# Altium project zulu_a7_hdi_optimized.PrjPcb (part 1 of 2)
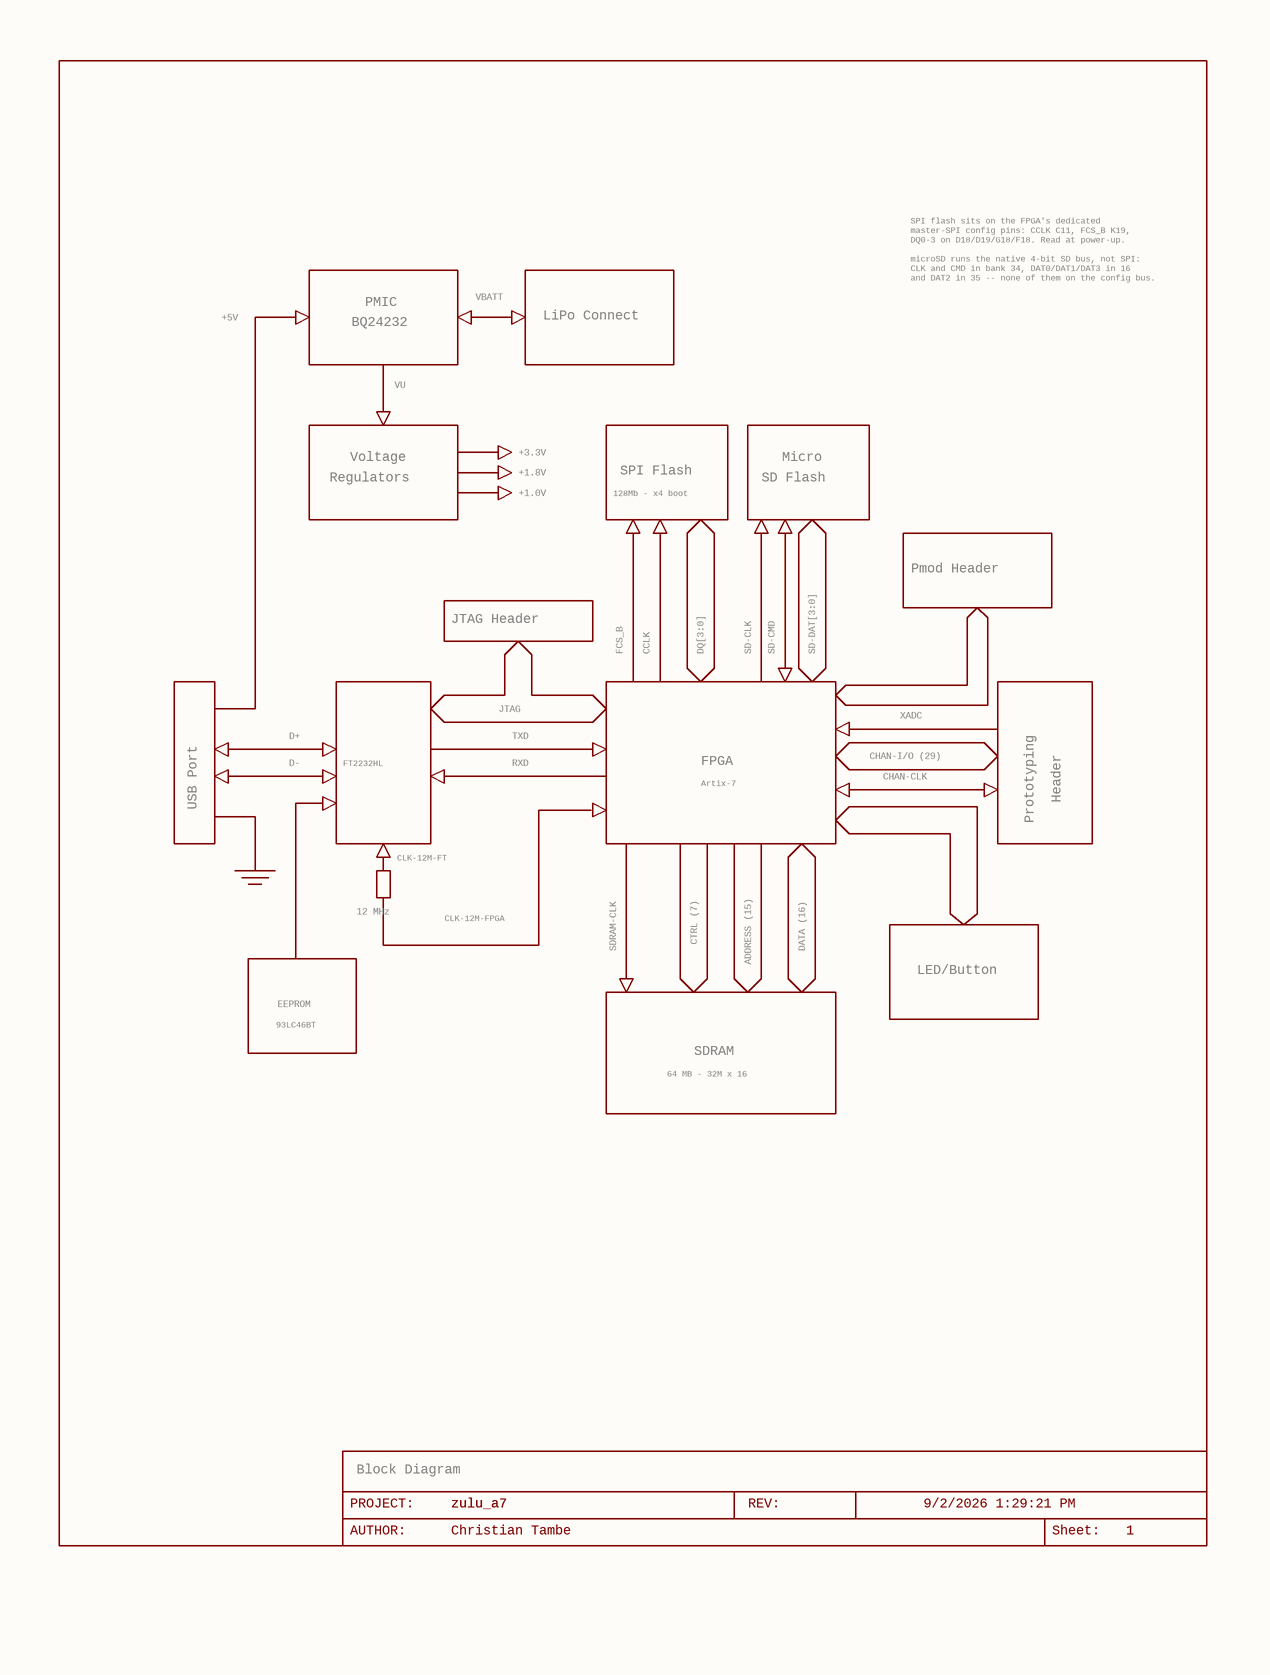
[diagram p0: zulu_a7_0.SchDoc]
6 sheets, 176 parts. Net scope: global (net labels, ports and power ports of the same name join across sheets).
Board file: zulu_a7_hdi_optimized.PcbDoc
Sheets:
  zulu_a7_0.SchDoc
  zulu_a7_1.SchDoc
  zulu_a7_2.SchDoc
  zulu_a7_3.SchDoc
  zulu_a7_4.SchDoc
  zulu_a7_6.SchDoc

## Sheet zulu_a7_0.SchDoc
size 236 x 313 mm; Author: Christian Tambe; VERSION#: 1.0; Origin: Eagle; OriginPath: C:\Users\tambe\Documents\Electronics\Zulu_A7\Zulu_Altrium\zulu_a7.sch; OriginSheet: 1; OriginDescription: Block Diagram

### Parts
FRAME1  LAST_DATE_TIME: 9/2/2026 1:29:21 PM  Sheet: Sheet:  SHEET: 1  REV: REV:  PROJECT: PROJECT:  DRAWING_NAME: zulu_a7  AUTHOR: Christian Tambe  (hidden comment: DOCFIELD)  (graphical)

### Notes on the sheet
- SPI flash sits on the FPGA's dedicated
  master-SPI config pins: CCLK C11, FCS_B K19,
  DQ0-3 on D18/D19/G18/F18. Read at power-up.
  microSD runs the native 4-bit SD bus, not SPI:
  CLK and CMD in bank 34, DAT0/DAT1/DAT3 in 16
  and DAT2 in 35 -- none of them on the config bus.
- +5V
- BQ24232
- PMIC
- VBATT
- LiPo Connect
- VU
- Regulators
- Voltage
- +3.3V
- +1.8V
- SPI Flash
- SD Flash
- Micro
- +1.0V
- 128Mb - x4 boot
- Pmod Header
- JTAG Header
- FCS_B
- CCLK
- DQ[3:0]
- SD-CLK
- SD-CMD
- SD-DAT[3:0]
- D+
- JTAG
- TXD
- XADC
- USB Port
- D-
- FT2232HL
- RXD
- FPGA
- Artix-7
- CHAN-I/O (29)
- CHAN-CLK
- Prototyping
- Header
- CLK-12M-FT
- 12 MHz
- CLK-12M-FPGA
- SDRAM-CLK
- CTRL (7)
- DATA (16)
- EEPROM
- ADDRESS (15)
- LED/Button
- 93LC46BT
- 64 MB - 32M x 16
- SDRAM
- (near FRAME1) Block Diagram
- (near FRAME1) AUTHOR:

### Library data of the parts
FRAME1 = DOCFIELD: DOCUMENT FIELD; GateName_1: G$1; SymbolName_1: DOCFIELD; LibraryName: ctambe; DeviceSetName: DOCFIELD

## Sheet zulu_a7_1.SchDoc
size 236 x 314 mm; Author: Christian Tambe; VERSION#: 1.0; Origin: Eagle; OriginPath: C:\Users\tambe\Documents\Electronics\Zulu_A7\Zulu_Altrium\zulu_a7.sch; OriginSheet: 2; OriginDescription: Power Supplies
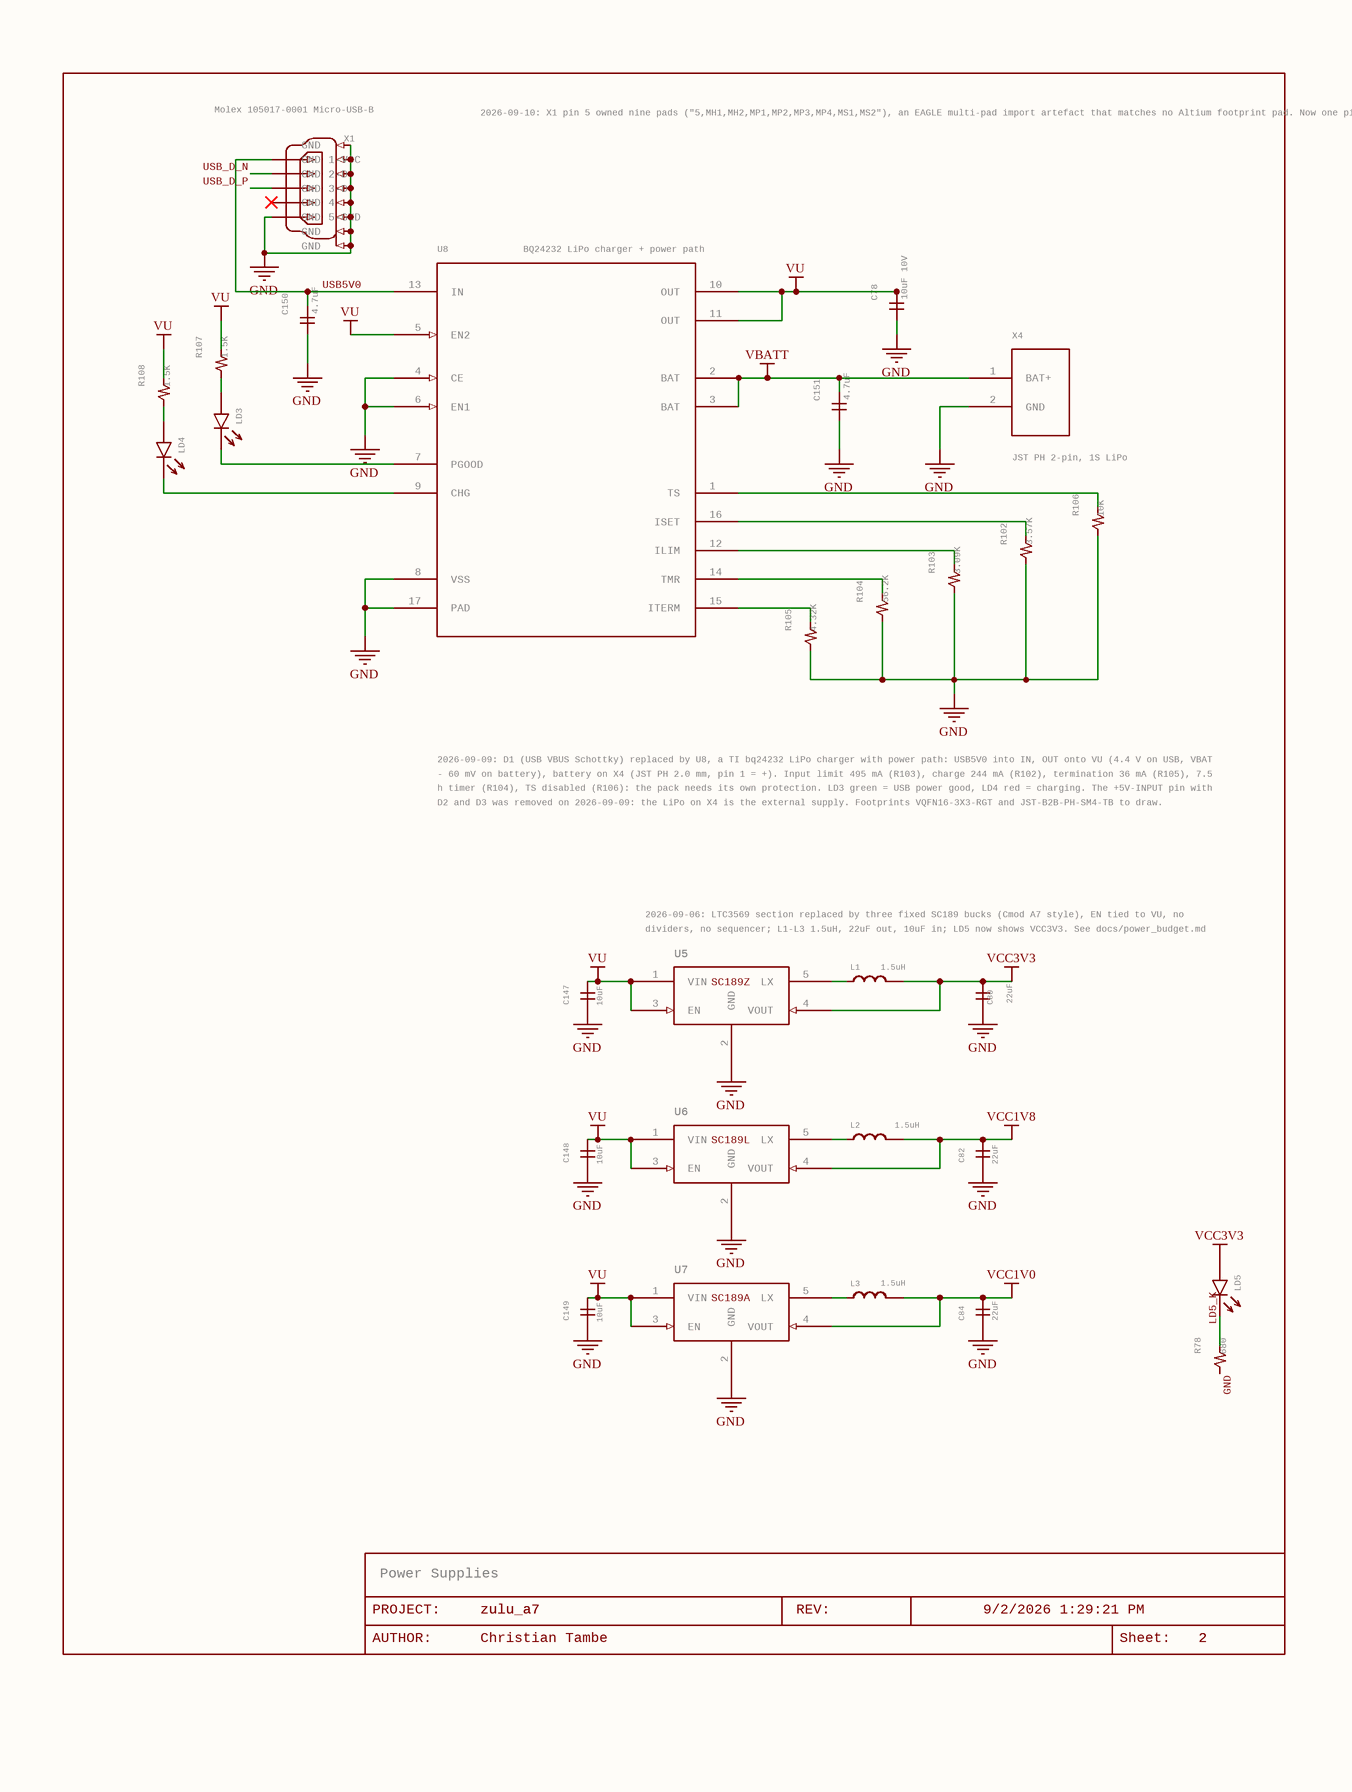
[diagram p1: zulu_a7_1.SchDoc]

### Parts
C78  10uF 10V  [C0805]
C80  22uF  [C0805]
C82  22uF  [C0603]
C84  22uF  [C0603]
C147  10uF  [C0805]
C148  10uF  [C0805]
C149  10uF  [C0805]
C150  4.7uF  [C0603]
C151  4.7uF  [C0603]
FRAME5  LAST_DATE_TIME: 9/2/2026 1:29:21 PM  Sheet: Sheet:  SHEET: 2  REV: REV:  PROJECT: PROJECT:  DRAWING_NAME: zulu_a7  AUTHOR: Christian Tambe  (hidden comment: DOCFIELD)  (graphical)
L1  1.5uH  [IND2520]
L2  1.5uH  [IND2520]
L3  1.5uH  [IND2520]
LD3  green  [LED0603]  (value not drawn)
LD4  red  [LED0603]  (value not drawn)
LD5  green  [LED0603]  (value not drawn)
R78  680  [R0402]
R102  3.57K  [R0402]
R103  3.09K  [R0402]
R104  56.2K  [R0402]
R105  4.32K  [R0402]
R106  10K  [R0402]
R107  1.5K  [R0402]
R108  1.5K  [R0402]
U5  PartName: SC189Z  [SOT23-5]  (hidden comment: SC189ZSKTRT)
U6  PartName: SC189L  [SOT23-5]  (hidden comment: SC189LSKTRT)
U7  PartName: SC189A  [SOT23-5]  (hidden comment: SC189ASKTRT)
U8  BQ24232 LiPo charger + power path  [VQFN16-3X3-RGT]
X1  Molex 105017-0001 Micro-USB-B  [MOLEX-105017-0001]
X4  JST PH 2-pin, 1S LiPo  [JST-B2B-PH-SM4-TB]

### Nets
GND: C78.1 C80.1 C82.1 C84.1 C147.1 C148.1 C149.1 C150.1 C151.1 R78.1 R102.1 R103.1 R104.1 R105.1 R106.1 U5.2(GND) U6.2(GND) U7.2(GND) U8.4(CE) U8.6(EN1) U8.8(VSS) U8.17(PAD) X1.5(5-GND) X1.MH1(GND) X1.MH2(GND) X1.MP1(GND) X1.MP2(GND) X1.MP3(GND) X1.MP4(GND) X1.MS1(GND) X1.MS2(GND) X4.2(GND)
VBATT: C151.2 U8.2(BAT) U8.3(BAT) X4.1(BAT+)
VCC1V0: C84.2 L3.2 U7.4(VOUT)
VCC1V8: C82.2 L2.2 U6.4(VOUT)
VCC3V3: C80.2 L1.2 LD5.A U5.4(VOUT)
VU: C78.2 C147.2 C148.2 C149.2 R107.2 R108.2 U5.1(VIN) U5.3(EN) U6.1(VIN) U6.3(EN) U7.1(VIN) U7.3(EN) U8.5(EN2) U8.10(OUT) U8.11(OUT)
LD5_K: LD5.K R78.2
USB5V0: C150.2 U8.13(IN) X1.1(1-VCC)
USB_D_N: X1.2(2-D-)
USB_D_P: X1.3(3-D+)
NetL1_1: L1.1 U5.5(LX)
NetL2_1: L2.1 U6.5(LX)
NetL3_1: L3.1 U7.5(LX)
NetLD3_A: LD3.A R107.1
NetLD3_K: LD3.K U8.7(PGOOD)
NetLD4_A: LD4.A R108.1
NetLD4_K: LD4.K U8.9(CHG)
NetR102_2: R102.2 U8.16(ISET)
NetR103_2: R103.2 U8.12(ILIM)
NetR104_2: R104.2 U8.14(TMR)
NetR105_2: R105.2 U8.15(ITERM)
NetR106_2: R106.2 U8.1(TS)

Not connected (* = marked no-connect by the designer): X1 4*

### Notes on the sheet
- 2026-09-10: X1 pin 5 owned nine pads ("5,MH1,MH2,MP1,MP2,MP3,MP4,MS1,MS2"), an EAGLE multi-pad import artefact that matches no Altium footprint pad. Now one pin per pad: 5 is USB GND, MH1/MH2 the mounting holes, MP1-MP4 the shell posts and MS1/MS2 the shield tabs, all on the same GND port.
- 2026-09-09: D1 (USB VBUS Schottky) replaced by U8, a TI bq24232 LiPo charger with power path: USB5V0 into IN, OUT onto VU (4.4 V on USB, VBAT
- - 60 mV on battery), battery on X4 (JST PH 2.0 mm, pin 1 = +). Input limit 495 mA (R103), charge 244 mA (R102), termination 36 mA (R105), 7.5
- h timer (R104), TS disabled (R106): the pack needs its own protection. LD3 green = USB power good, LD4 red = charging. The +5V-INPUT pin with
- D2 and D3 was removed on 2026-09-09: the LiPo on X4 is the external supply. Footprints VQFN16-3X3-RGT and JST-B2B-PH-SM4-TB to draw.
- 2026-09-06: LTC3569 section replaced by three fixed SC189 bucks (Cmod A7 style), EN tied to VU, no
- dividers, no sequencer; L1-L3 1.5uH, 22uF out, 10uF in; LD5 now shows VCC3V3. See docs/power_budget.md
- (near FRAME5) Power Supplies
- (near FRAME5) AUTHOR:

### Library data of the parts
C78 C147-C149 = C-GENERICC0805: CAPACITOR, generic non-polarized, horizontal pins; GateName_1: G$1; SymbolName_1: C-GENERIC-H; MANF: Samsung; MANF#: CL21A106KPFNNNG; SPEC: X5R 10V +-10% 0805 10uF; replaces the obsolete Murata GRM21BR61A106KE19L; DeviceName: C0805; LibraryName: rcl; DeviceSetName: C-GENERIC
C80 = C-GENERICC0805: CAPACITOR, generic non-polarized, horizontal pins; GateName_1: G$1; SymbolName_1: C-GENERIC-H; MANF: Murata; MANF#: GRM21BR61A226ME44L; SPEC: X5R 10V +-20%, 1.45 mm max -- SC189 COUT on VCC3V3, sense pin 4 lands here; DeviceName: C0805; LibraryName: rcl; DeviceSetName: C-GENERIC
C82 C84 = C-GENERICC0603: CAPACITOR, generic non-polarized, horizontal pins; GateName_1: G$1; SymbolName_1: C-GENERIC-H; MANF: Samsung; MANF#: CL10A226MP8NUNE; SPEC: X5R 10V +-20% 0603 22uF, 1.05 mm max (T 0.80 +-0.25); replaced the 6.3 V Murata GRM188R60J226MEA0D (1.00 mm max, dry until 2027) on 2026-09-07; DeviceName: C0603; LibraryName: rcl; DeviceSetName: C-GENERIC
C150 C151 = C-GENERICC0603: CAPACITOR, generic non-polarized, horizontal pins; GateName_1: G$1; SymbolName_1: C-GENERIC-H; MANF: Murata; MANF#: GRM188R61C475KE11D; SPEC: X5R 16V +-10% 0603 4.7uF, 0.95 mm max (bq24232 IN/BAT bypass, datasheet 1-10 uF on IN and 4.7-47 uF on BAT); DeviceName: C0603; LibraryName: rcl; DeviceSetName: C-GENERIC
FRAME5 = DOCFIELD: DOCUMENT FIELD; GateName_1: G$1; SymbolName_1: DOCFIELD; LibraryName: ctambe; DeviceSetName: DOCFIELD
L1-L3 = INDUCTOR-2520: INDUCTOR, generic power inductor; GateName_1: G$1; DeviceName: -2520; MANF: Murata; MANF#: DFE252010P-1R5M=P2; SPEC: 1.5uH +-20%, Isat >=1.8A, 1.00 mm max -- SC189 LX inductor, 2.5 MHz, <=0.31 A p-p ripple; SymbolName_1: INDUCTOR; LibraryName: ctambe; DeviceSetName: INDUCTOR
LD3 = LED: GateName_1: G$1; MANF: Lite-On; MANF#: LTST-C191KGKT; NOTE: Charger power-good: bq24232 PGOOD sinks LD3 through R107 1.5k from VU when a valid USB input is present; SPEC: green indicator, 0603, Vf 2.1V max at 2mA; SymbolName_1: LED; LibraryName: ctambe; DeviceSetName: LED
LD4 = LED: GateName_1: G$1; MANF: Lite-On; MANF#: LTST-C191KRKT; NOTE: Charging: bq24232 CHG sinks LD4 through R108 1.5k from VU while the battery charges, off when done or disabled; SPEC: red indicator, 0603, Vf 2.0V typ at 2mA; SymbolName_1: LED; LibraryName: ctambe; DeviceSetName: LED
LD5 = LED: GateName_1: G$1; MANF: Lite-On; MANF#: LTST-C191KGKT; NOTE: Power-good indicator: VCC3V3 to LD5 to R78 680R to Q2 drain to GND. SELECTED FROM THE CIRCUIT, not recovered -- the part carried no value and no number. THE RESISTOR ALREADY CHOSE THE COLOUR: 680R off 3.3 V passes (3.3 - Vf)/680, which is 1.9 mA for a green LED or 2.1 for a red, but only 0.6 mA for a blue or white one, too dim to read. So it is a green or red part, and green is the convention for power good. 1.9 mA is low but plain on a modern high-efficiency 0603; take R78 to 330R if you want it brighter.; SPEC: green indicator, 0603, Vf 2.1V max at 2mA; SymbolName_1: LED; LibraryName: ctambe; DeviceSetName: LED
R78 = R-US_SMALLR0402: RESISTOR, American symbol, small 2-zigzag variant (sheet 2 only); GateName_1: G$1; MANF: Yageo; MANF#: RC0402FR-07680RL; SPEC: thick film +-1%, 1/16W, 0402; SymbolName_1: R-US_SMALL; DeviceName: R0402; LibraryName: rcl; DeviceSetName: R-US_SMALL
R102 = R-US_SMALLR0402: RESISTOR, American symbol, small 2-zigzag variant (sheet 2 only); GateName_1: G$1; MANF: Yageo; MANF#: RC0402FR-073K57L; SPEC: thick film +-1%, 1/16W, 0402 -- ISET: 870 / 3.57k = 244 mA fast-charge current; SymbolName_1: R-US_SMALL; DeviceName: R0402; LibraryName: rcl; DeviceSetName: R-US_SMALL
R103 = R-US_SMALLR0402: RESISTOR, American symbol, small 2-zigzag variant (sheet 2 only); GateName_1: G$1; MANF: Yageo; MANF#: RC0402FR-073K09L; SPEC: thick film +-1%, 1/16W, 0402 -- ILIM: 1530 / 3.09k = 495 mA input current limit (EN2 = VU, EN1 = GND select the resistor); SymbolName_1: R-US_SMALL; DeviceName: R0402; LibraryName: rcl; DeviceSetName: R-US_SMALL
R104 = R-US_SMALLR0402: RESISTOR, American symbol, small 2-zigzag variant (sheet 2 only); GateName_1: G$1; MANF: Yageo; MANF#: RC0402FR-0756K2L; SPEC: thick film +-1%, 1/16W, 0402 -- TMR: 10 x 56.2k x 48 s/k = 7.5 h fast-charge and 45 min precharge safety timers; SymbolName_1: R-US_SMALL; DeviceName: R0402; LibraryName: rcl; DeviceSetName: R-US_SMALL
R105 = R-US_SMALLR0402: RESISTOR, American symbol, small 2-zigzag variant (sheet 2 only); GateName_1: G$1; MANF: Yageo; MANF#: RC0402FR-074K32L; SPEC: thick film +-1%, 1/16W, 0402 -- ITERM: 0.03 A x 4.32k / 3.57k = 36 mA termination (15 % of the charge current); SymbolName_1: R-US_SMALL; DeviceName: R0402; LibraryName: rcl; DeviceSetName: R-US_SMALL
R106 = R-US_SMALLR0402: RESISTOR, American symbol, small 2-zigzag variant (sheet 2 only); GateName_1: G$1; MANF: Yageo; MANF#: RC0402FR-0710KL; SPEC: thick film +-1%, 1/16W, 0402 -- TS: fixed 10k disables the pack-temperature check (2-pin pack, no NTC); the pack must carry its own protection; SymbolName_1: R-US_SMALL; DeviceName: R0402; LibraryName: rcl; DeviceSetName: R-US_SMALL
R107 = R-US_SMALLR0402: RESISTOR, American symbol, small 2-zigzag variant (sheet 2 only); GateName_1: G$1; MANF: Yageo; MANF#: RC0402FR-071K5L; SPEC: thick film +-1%, 1/16W, 0402 -- PGOOD LED current: (4.4 - 2.1) / 1.5k = 1.5 mA; SymbolName_1: R-US_SMALL; DeviceName: R0402; LibraryName: rcl; DeviceSetName: R-US_SMALL
R108 = R-US_SMALLR0402: RESISTOR, American symbol, small 2-zigzag variant (sheet 2 only); GateName_1: G$1; MANF: Yageo; MANF#: RC0402FR-071K5L; SPEC: thick film +-1%, 1/16W, 0402 -- CHG LED current: (4.4 - 2.0) / 1.5k = 1.6 mA; SymbolName_1: R-US_SMALL; DeviceName: R0402; LibraryName: rcl; DeviceSetName: R-US_SMALL
U5-U7 = SC189-SOT23-5: 1.5A 2.5MHz synchronous buck, fixed output (Semtech SC189); MANF: Semtech
  U5: MANF#: SC189ZSKTRT
  U6: MANF#: SC189LSKTRT
  U7: MANF#: SC189ASKTRT
U8 = BQ24232-RGT16: TI bq24232 single-cell Li-ion charger and power-path manager, 16-pin VQFN 3x3 (RGT) with thermal pad; GateName_1: G$1; MANF: Texas Instruments; MANF#: BQ24232RGTR; SPEC: single-cell Li-ion/LiPo linear charger with power path, 16-pin VQFN 3 x 3 mm (RGT), IN 4.35-10.2 V with 10.5 V OVP, OUT 4.4 V regulated or VBAT - 60 mV on battery, input limit 495 mA (R103), charge 244 mA (R102), termination 36 mA (R105), 7.5 h timer (R104), TS disabled with 10k (R106), CE and EN1 to GND, EN2 to VU; thetaJA 44.5 C/W; added 2026-09-09 in place of D1; NOTE: bq24232 (SLUS821J): USB5V0 into IN, OUT onto VU, battery on BAT/X4. With USB present OUT is 4.4 V (LDO) and the input is capped at 495 mA: DPPM trims the charge current first, then the battery supplements the load; the board therefore never draws more than the limit from the port. On battery alone VU = VBAT - 60 mV, and the 3.3 V buck holds regulation down to about 3.45 V. The +5V-INPUT path with D2 and D3 was removed on 2026-09-09, so the charger is the only input. Dissipation about 0.6 W worst case (0.3 W power path at 500 mA plus 0.3 W charging), a 27 C rise at 44.5 C/W. Battery-only start-up into the 40 uF on VU relies on the part's inrush sequence and the 250 mV / 250 us short-circuit detector: scope it on the first board. Footprint VQFN16-3X3-RGT to draw from the datasheet package drawing (3 x 3 mm, 0.5 mm pitch, 1.68 mm pad). Digi-Key 541 in stock at $1.93 on 2026-09-09.; SymbolName_1: BQ24232; DeviceName: RGT; LibraryName: ctambe; DeviceSetName: BQ24232
X1 = MINI-USB-105017-0001: MINI USB Connector   Source: http://www.hirose.co.jp/cataloge_hp/e24000019.pdf; GateName_1: G$1; SymbolName_1: MINI-USB; DeviceName: 105017-0001; LibraryName: ctambe; DeviceSetName: MINI-USB-; MANF: Molex; MANF#: 105017-0001
X4 = JST-B2B-PH-SM4-TB: JST PH 2.0 mm 2-pin top-entry SMT header, LiPo battery input; GateName_1: G$1; SymbolName_1: CONN-2; DeviceName: SM4-TB; DeviceSetName: JST-PH-2; MANF#: B2B-PH-SM4-TB(LF)(SN); SPEC: JST PH 2.0 mm, 2 circuits, top-entry SMT header with fixing tabs, 2 A, 100 V, -25..85 C, mates with PHR-2 housing; pin 1 = battery +, pin 2 = GND; NOTE: B2B-PH-SM4-TB(LF)(SN): 8 mm tall, wire leaves upward; the side-entry twin is S2B-PH-SM4-TB(LF)(SN) (5.5 mm). There is no polarity standard for JST-PH LiPo packs: check pin 1 = + against the pack before plugging in. Footprint JST-B2B-PH-SM4-TB to draw from the catalog page (two contact pads on 2.0 mm plus two 1.6 x 3.0 mm fixing pads). Digi-Key 57,541 in stock at $0.47 on 2026-09-09.; LibraryName: ctambe; MANF: JST

## Sheet zulu_a7_2.SchDoc
size 270 x 341 mm; Author: Christian Tambe; VERSION#: 1.0; Origin: Eagle; OriginPath: C:\Users\tambe\Documents\Electronics\Zulu_A7\Zulu_Altrium\zulu_a7.sch; OriginSheet: 3; OriginDescription: General IO
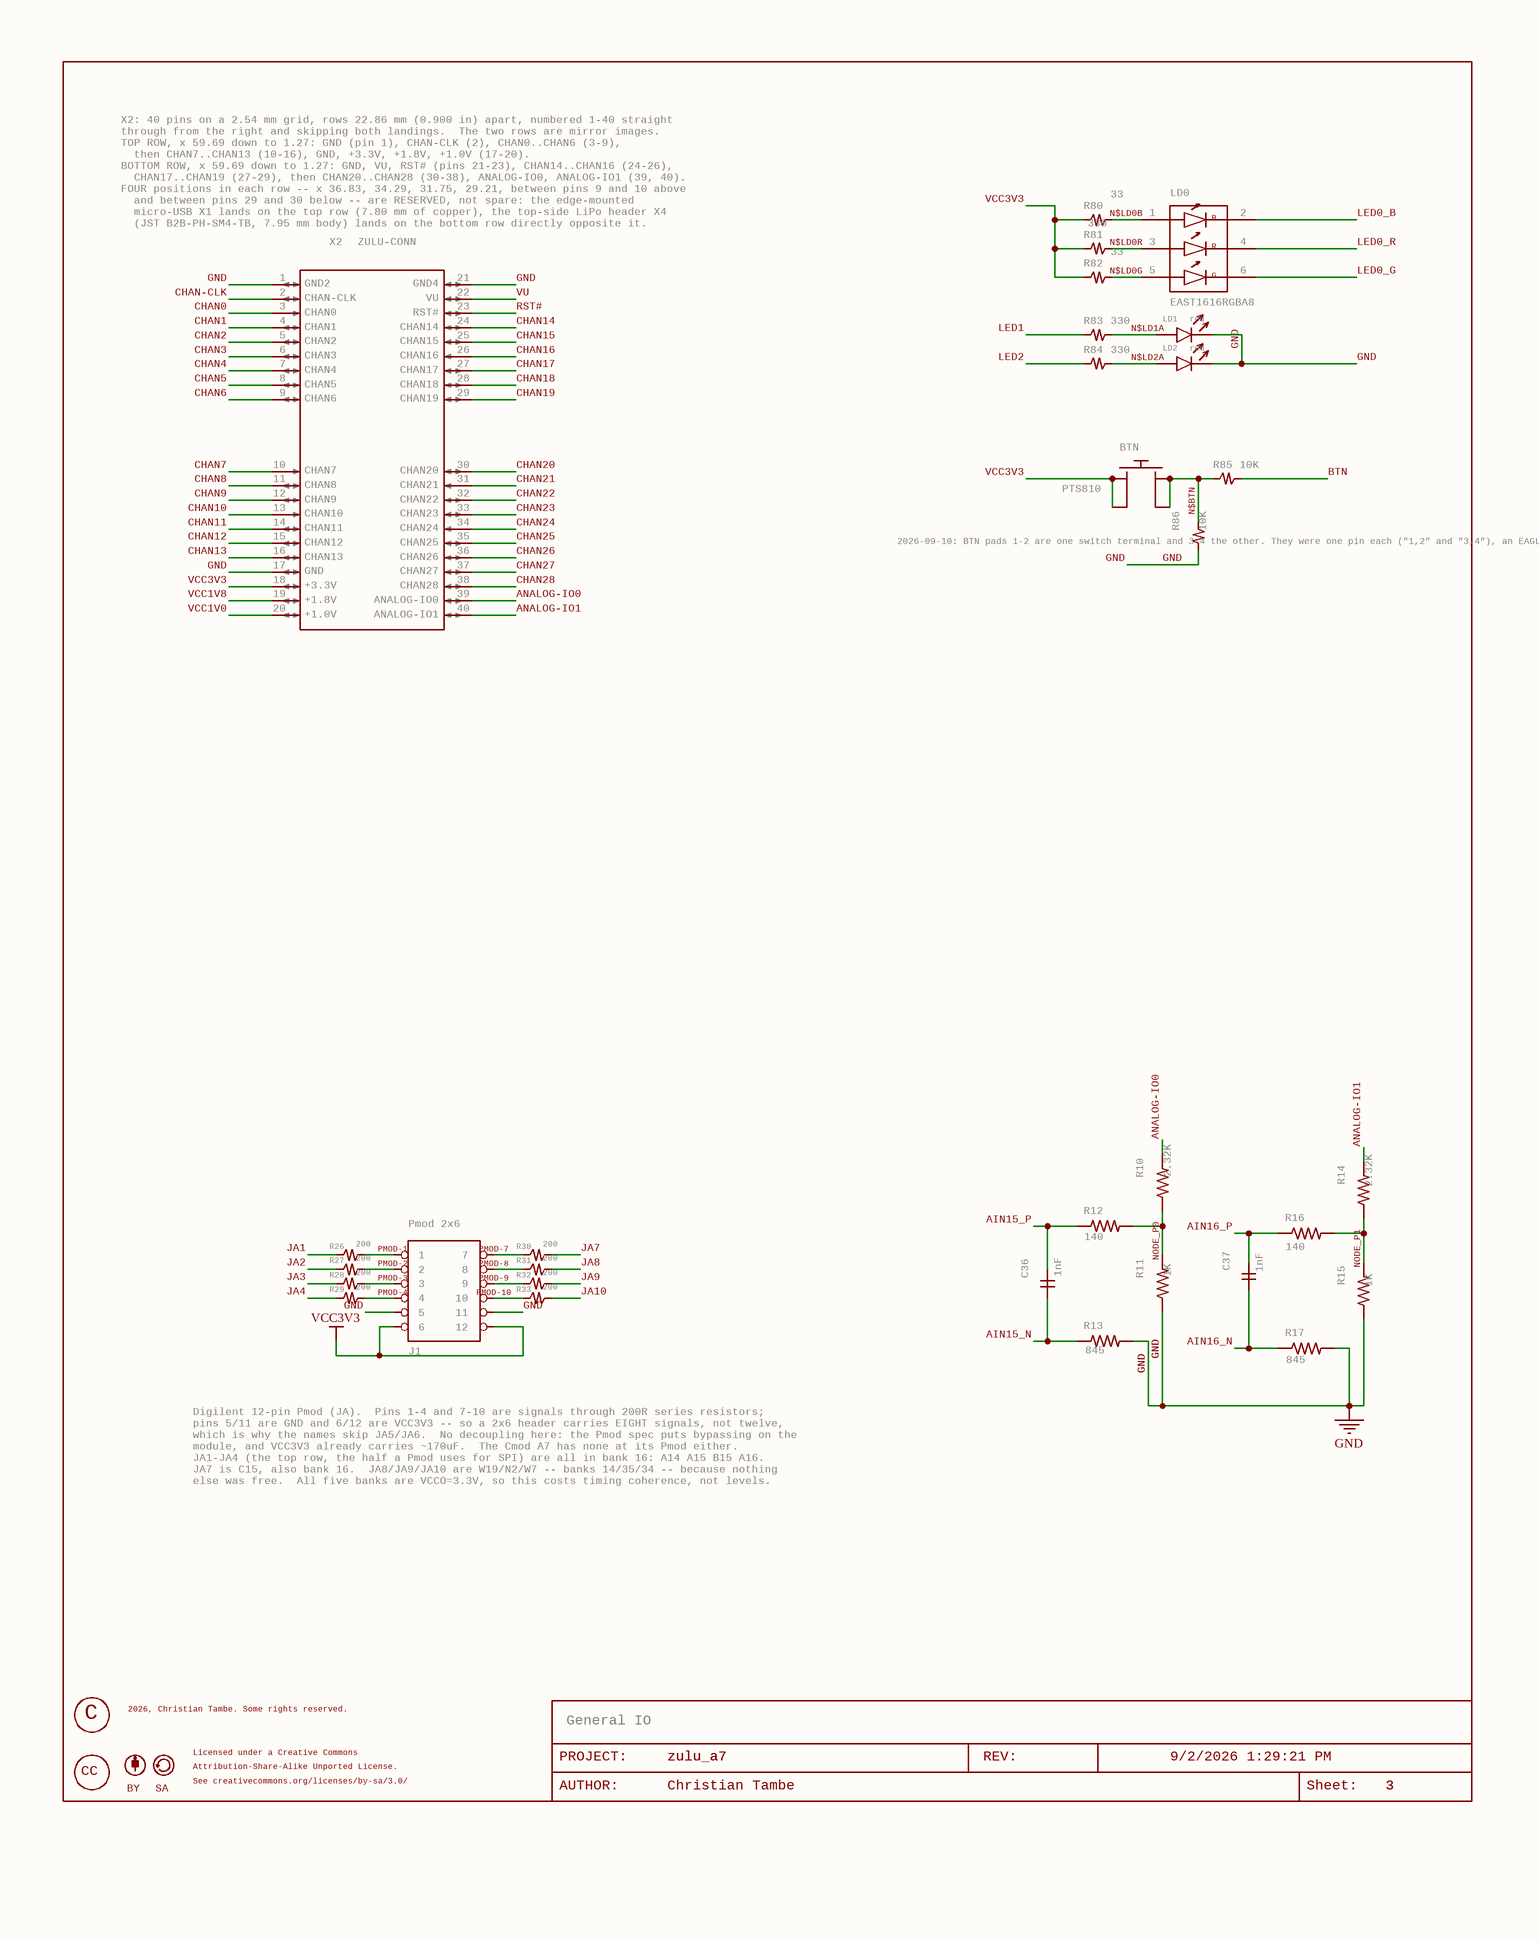
[diagram p2: zulu_a7_2.SchDoc]

### Parts
BTN  PTS810  [PTS810]
C36  1nF  [C0402]
C37  1nF  [C0402]
FRAME3  LAST_DATE_TIME: 9/2/2026 1:29:21 PM  Sheet: Sheet:  SHEET: 3  REV: REV:  PROJECT: PROJECT:  DRAWING_NAME: zulu_a7  AUTHOR: Christian Tambe  (hidden comment: DOCFIELD)  (graphical)
J1  Pmod 2x6  [2X06]
LD0  EAST1616RGBA8  [EVERLIGHT-19-337]
LD1  red  [LED0603]
LD2  red  [LED0603]
R10  2.32K  [R0201]
R11  1K  [R0201]
R12  140  [R0201]
R13  845  [R0201]
R14  2.32K  [R0201]
R15  1K  [R0201]
R16  140  [R0201]
R17  845  [R0201]
R26  200  [R0201]
R27  200  [R0201]
R28  200  [R0201]
R29  200  [R0201]
R30  200  [R0201]
R31  200  [R0201]
R32  200  [R0201]
R33  200  [R0201]
R80  33  [R0402]
R81  330  [R0402]
R82  33  [R0402]
R83  330  [R0402]
R84  330  [R0402]
R85  10K  [R0402]
R86  10K  [R0402]
U$2  CC_CC  [CC_CC]  (value not drawn)
U$3  CC_BY  [CC_BY]  (value not drawn)
U$4  CC_SA  [CC_SA]  (value not drawn)
U$5  CC_COPYRIGHT  [CC_COPYRIGHT]  (value not drawn)
X2  GATE: CHAN-CLK  [ZULU-DIP37]  (hidden comment: ZULU-CONN)  (parts A,B,C,D,E,F,G,H,I,J,K,L,M,N,O,P,Q,R,S,T,U,V,W,X,Y,Z,27,28,29,30,31,32,33,34,35,36,37,38,39,40,41 of 41)

### Nets
GND: J1.5 J1.11 LD1.K LD2.K R11.1 R13.2 R15.1 R17.2 R86.1 X2.1 X2.17 X2.21
VCC1V0: X2.20
VCC1V8: X2.19
VCC3V3: BTN.1 BTN.2 J1.6 J1.12 R80.1 R81.1 R82.1 X2.18
VU: X2.22
AIN15_N: C36.1 R13.1
AIN15_P: C36.2 R12.1
AIN16_N: C37.1 R17.1
AIN16_P: C37.2 R16.1
ANALOG-IO0: R10.2 X2.39
ANALOG-IO1: R14.2 X2.40
BTN: R85.2
CHAN0: X2.3
CHAN1: X2.4
CHAN2: X2.5
CHAN3: X2.6
CHAN4: X2.7
CHAN5: X2.8
CHAN6: X2.9
CHAN7: X2.10
CHAN8: X2.11
CHAN9: X2.12
CHAN10: X2.13
CHAN11: X2.14
CHAN12: X2.15
CHAN13: X2.16
CHAN14: X2.24
CHAN15: X2.25
CHAN16: X2.26
CHAN17: X2.27
CHAN18: X2.28
CHAN19: X2.29
CHAN20: X2.30
CHAN21: X2.31
CHAN22: X2.32
CHAN23: X2.33
CHAN24: X2.34
CHAN25: X2.35
CHAN26: X2.36
CHAN27: X2.37
CHAN28: X2.38
CHAN-CLK: X2.2
JA1: R26.1
JA2: R27.1
JA3: R28.1
JA4: R29.1
JA7: R30.2
JA8: R31.2
JA9: R32.2
JA10: R33.2
LED0_B: LD0.2
LED0_G: LD0.6
LED0_R: LD0.4
LED1: R83.1
LED2: R84.1
N$BTN: BTN.3 BTN.4 R85.1 R86.2
N$LD0B: LD0.1 R80.2
N$LD0G: LD0.5 R82.2
N$LD0R: LD0.3 R81.2
N$LD1A: LD1.A R83.2
N$LD2A: LD2.A R84.2
NODE_P0: R10.1 R11.2 R12.2
NODE_P1: R14.1 R15.2 R16.2
PMOD-1: J1.1 R26.2
PMOD-2: J1.2 R27.2
PMOD-3: J1.3 R28.2
PMOD-4: J1.4 R29.2
PMOD-7: J1.7 R30.1
PMOD-8: J1.8 R31.1
PMOD-9: J1.9 R32.1
PMOD-10: J1.10 R33.1
RST#: X2.23

### Notes on the sheet
- (near X2) X2: 40 pins on a 2.54 mm grid, rows 22.86 mm (0.900 in) apart, numbered 1-40 straight
  through from the right and skipping both landings.  The two rows are mirror images.
  TOP ROW, x 59.69 down to 1.27: GND (pin 1), CHAN-CLK (2), CHAN0..CHAN6 (3-9),
  then CHAN7..CHAN13 (10-16), GND, +3.3V, +1.8V, +1.0V (17-20).
  BOTTOM ROW, x 59.69 down to 1.27: GND, VU, RST# (pins 21-23), CHAN14..CHAN16 (24-26),
  CHAN17..CHAN19 (27-29), then CHAN20..CHAN28 (30-38), ANALOG-IO0, ANALOG-IO1 (39, 40).
  FOUR positions in each row -- x 36.83, 34.29, 31.75, 29.21, between pins 9 and 10 above
  and between pins 29 and 30 below -- are RESERVED, not spare: the edge-mounted
  micro-USB X1 lands on the top row (7.80 mm of copper), the top-side LiPo header X4
  (JST B2B-PH-SM4-TB, 7.95 mm body) lands on the bottom row directly opposite it.
  Each landing is 12.70 mm between the neighbouring pin centres, 11.176 mm clear.
  THREE grounds: pins 1, 17, 21.  Pin 18 is the only +3.3V pin.  Pin 22 VU SOURCES the
  4.4 V rail (bq24232 OUT) -- the +5V-INPUT pin and its D2/D3 went on 2026-09-09,
  so external power is the LiPo on X4.  THE PCB FOOTPRINT MUST BE REDRAWN: 40 pads named 1-40.
- (near R86) 2026-09-10: BTN pads 1-2 are one switch terminal and 3-4 the other. They were one pin each ("1,2" and "3,4"), an EAGLE multi-pad import artefact that matches no Altium footprint pad; now four pins, each pad on its partner's net.
- Digilent 12-pin Pmod (JA).  Pins 1-4 and 7-10 are signals through 200R series resistors;
  pins 5/11 are GND and 6/12 are VCC3V3 -- so a 2x6 header carries EIGHT signals, not twelve,
  which is why the names skip JA5/JA6.  No decoupling here: the Pmod spec puts bypassing on the
  module, and VCC3V3 already carries ~170uF.  The Cmod A7 has none at its Pmod either.
  JA1-JA4 (the top row, the half a Pmod uses for SPI) are all in bank 16: A14 A15 B15 A16.
  JA7 is C15, also bank 16.  JA8/JA9/JA10 are W19/N2/W7 -- banks 14/35/34 -- because nothing
  else was free.  All five banks are VCCO=3.3V, so this costs timing coherence, not levels.
- 2026, Christian Tambe. Some rights reserved.
- (near FRAME3) General IO
- (near U$4) Licensed under a Creative Commons
- (near U$4) Attribution-Share-Alike Unported License.
- (near U$4) See creativecommons.org/licenses/by-sa/3.0/
- (near FRAME3) AUTHOR:

### Library data of the parts
BTN = SWITCH_TACT: Tactile switch, momentary, normally open. Package PTA-142 is assigned and drawn from the datasheet land; the note that said otherwise was left behind when it was.; GateName_1: G$1; MANF#: PTS810SJM250SMTR LFS; MANF: Littelfuse (C&K); NOTE: PTS810SJM250SMTR LFS, Littelfuse (C&K) PTS810 series, Datasheet/Littelfuse-CK-Tactile-PTS810-Series-Datasheet.pdf rev 02/02/26. Recommended PCB layout (p1): four pads (5.2 - 3.1)/2 = 1.05 mm wide by (2.8 - 1.5)/2 = 0.65 mm high, centred at +-2.075 mm and +-1.075 mm; body 4.2 x 3.2 mm, J-leads to 4.6 mm, height 2.5 mm. The datasheet schematic joins 1 with 2 and 3 with 4, so pins 1,2 (VCC3V3) and 3,4 (BTN) are unchanged. Footprint PTS810 to be drawn at the PCB stage; the PTA-142 pattern (1.6 mm pads at +-3.75 / +-1.4 mm) does not fit. Other force grades on the same pads: K 2.6 N, G 4.0 N, S 6.0 N. Digi-Key 106,352 in stock at $0.58, 16-week lead (2026-09-08); LCSC C116501 dry, the K grade C221896 stocked.; SPEC: tactile switch SPST-NO momentary, SMT J-lead, 4.2 x 3.2 x 2.5 mm, 1.6 N (160 gf), 0.15 mm travel, 150000 cycles, 16 VDC 50 mA, -40..85 C; terminals 1-2 and 3-4 internally common (PTS810 sheet p1); replaced the unsourceable PTA-142 on 2026-09-08; SymbolName_1: SWITCH_TACT; LibraryName: ctambe; DeviceSetName: SWITCH_TACT
C36 C37 = C-GENERICC0402: CAPACITOR, generic non-polarized, horizontal pins; GateName_1: G$1; SymbolName_1: C-GENERIC-H; MANF: Murata; MANF#: GRM155R71H102KA01D; SPEC: X7R 50V +-10%, 0.50 mm max; DeviceName: C0402; LibraryName: rcl; DeviceSetName: C-GENERIC
FRAME3 = DOCFIELD: DOCUMENT FIELD; GateName_1: G$1; SymbolName_1: DOCFIELD; LibraryName: ctambe; DeviceSetName: DOCFIELD
J1 = PINHD-2X6: PIN HEADER 2x6 (Pmod)   Digilent peripheral-module connector. Pins 1-4 and 7-10 are signals, 5 and 11 are GND, 6 and 12 are VCC -- eight signals, not twelve.; GateName_1: G$1; SymbolName_1: PINH2X6; MANF: Sullins; MANF#: PPTC062LFBN-RC; NOTE: A SOCKET, NOT PINS, AND THE LIBRARY NAME DISAGREES WITH THAT. The package is called PIN HEADER 2x6 and the deviceset PINHD-2X6, which is inherited naming, but on a Digilent Pmod the HOST carries the female socket and the peripheral module carries the male pins that plug into it. Cmod A7 is the same. Order male pins off that library name and no Pmod will mate. The footprint is 12 plated holes on 2.54 either way, so a male header such as Sullins PRPC006DAAN-RC drops into the same land if you would rather have pins and a cable. Height 8.5 mm is not a problem: J1 is on the FRONT, and it is the back that faces a breadboard a couple of millimetres away.; SPEC: 2x6 female header, 2.54 mm pitch, through-hole, 12 way -- Pmod host socket; LibraryName: ctambe; DeviceSetName: PINHD-2X6
LD0 = LED_RGB: RGB LED, three independent diodes, 6 pads: anodes 1/3/5 (B/R/G), cathodes 2/4/6 (B/R/G). Everlight 19-337 package.; GateName_1: G$1; NOTE: Everlight EAST1616RGBA8 = 19-337/R6GHBHW-A01/2T (DSE-0009126 Rev.3, 22-Dec-2016); water-clear twin EAST1616RGBA4 = 19-337/R6GHBHC-A01/2T. Same body, lens and recommended pads as the Victory VS NRD8 it replaces (0.55 x 0.4 outer pads at +-0.725 mm, 0.7 x 0.5 middle, 1.9 / 2.2 mm spans) and the same arrangement: cathodes in the left column under the cathode mark, blue / red / green top to bottom, anodes on the right. Only the numbering differs (Everlight anodes 1/3/5 on the right, cathodes 2/4/6 on the left), so on 2026-09-08 the pins were renumbered 1/2/3 -> 2/4/6 and 4/5/6 -> 1/3/5 with the nets unchanged: LED0_B/R/G on the cathodes to the FPGA, N$LD0B/R/G on the anodes through R80/R81/R82. Footprint EVERLIGHT-19-337 = the VS-NRD8 pattern with Everlight pad numbers. Digi-Key 15,840 in stock at $0.43 on 2026-09-08.; SPEC: RGB LED, three independent diodes, 1.6 x 1.6 x 0.35 mm, diffused lens, 624 / 525 / 468 nm, VF typ 2.05 / 3.2 / 3.2 V (max 2.4 / 3.7 / 3.7), IF 25 mA max per colour; anodes 1 B, 3 R, 5 G, cathodes 2 B, 4 R, 6 G (19-337 sheet p8); replaced the distributor-less Victory VS NRD8 on 2026-09-08; SymbolName_1: LED_RGB; LibraryName: ctambe; DeviceSetName: LED_RGB; B: B; R: R; G: G; MANF: Everlight; MANF#: EAST1616RGBA8
LD1 = LED: GateName_1: G$1; MANF: Lite-On; MANF#: LTST-C191KRKT; NOTE: User status LED, driven straight off an FPGA pin through R83 at 330R: (3.3 - Vf)/330 is 3.9 mA green, 4.2 red, 3.6 yellow, and 1.2 mA blue or white. Any of the first three is comfortable and well inside an LVCMOS33 pin's 12 mA. RED IS A PREFERENCE, NOT A CONSTRAINT -- the circuit takes green just as happily. It is red so that the two user LEDs read differently from LD5, which is green and means power good; on a board being brought up that is worth being able to tell apart at a glance. Same LTST-C191 family and the same 0603 land as LD5, so it is one line in the catalogue, not two. Confirm the suffix before ordering.; SPEC: red indicator, 0603, Vf 2.1V max at 4mA; SymbolName_1: LED; LibraryName: ctambe; DeviceSetName: LED
LD2 = LED: GateName_1: G$1; MANF: Lite-On; MANF#: LTST-C191KRKT; NOTE: User status LED, driven straight off an FPGA pin through R84 at 330R: (3.3 - Vf)/330 is 3.9 mA green, 4.2 red, 3.6 yellow, and 1.2 mA blue or white. Any of the first three is comfortable and well inside an LVCMOS33 pin's 12 mA. RED IS A PREFERENCE, NOT A CONSTRAINT -- the circuit takes green just as happily. It is red so that the two user LEDs read differently from LD5, which is green and means power good; on a board being brought up that is worth being able to tell apart at a glance. Same LTST-C191 family and the same 0603 land as LD5, so it is one line in the catalogue, not two. Confirm the suffix before ordering.; SPEC: red indicator, 0603, Vf 2.1V max at 4mA; SymbolName_1: LED; LibraryName: ctambe; DeviceSetName: LED
R10 R14 = R-US_R0201: RESISTOR, American symbol; GateName_1: G$1; SymbolName_1: R-US; DeviceSetName: R-US_; MANF: Yageo; MANF#: RC0201FR-072K32L; SPEC: thick film +-1%, 1/20W, 0201; DeviceName: R0201; LibraryName: rcl
R11 R15 = R-US_R0201: RESISTOR, American symbol; GateName_1: G$1; SymbolName_1: R-US; DeviceSetName: R-US_; MANF: Yageo; MANF#: RC0201FR-071KL; SPEC: thick film +-1%, 1/20W, 0201; DeviceName: R0201; LibraryName: rcl
R12 R16 = R-US_R0201: RESISTOR, American symbol; GateName_1: G$1; SymbolName_1: R-US; DeviceSetName: R-US_; MANF: Yageo; MANF#: RC0201FR-07140RL; SPEC: thick film +-1%, 1/20W, 0201; DeviceName: R0201; LibraryName: rcl
R13 R17 = R-US_R0201: RESISTOR, American symbol; GateName_1: G$1; SymbolName_1: R-US; DeviceSetName: R-US_; MANF: Yageo; MANF#: RC0201FR-07845RL; SPEC: thick film +-1%, 1/20W, 0201; DeviceName: R0201; LibraryName: rcl
R26-R33 = R-US_SMALLR0201: RESISTOR, American symbol, small 2-zigzag variant (sheet 2 only); GateName_1: G$1; MANF: Yageo; MANF#: RC0201FR-07200RL; SPEC: thick film +-1%, 1/20W, 0201; SymbolName_1: R-US_SMALL; DeviceName: R0201; LibraryName: rcl; DeviceSetName: R-US_SMALL
R80 R82 = R-US_SMALLR0402: RESISTOR, American symbol, small 2-zigzag variant (sheet 2 only); GateName_1: G$1; MANF: Yageo; MANF#: RC0402FR-0733RL; NOTE: RGB LED balance. The green and blue dice are 3.3 V-class parts on a 3.3 V rail, so the resistor never dominates their current -- that is structural and no resistor value fixes it. What the values CAN do is stop red swamping the other two. As built, and as Cmod A7 ships the same LED, 182/182/100 gave red 6.9 mA against green 1.9 and blue 1.5: red about four times either. At 330/33/33 it is red 3.8, green 2.9, blue 2.9. Worst case improves too, not just nominal -- green with a part 0.15 V high in Vf goes from 1.4 mA to 1.8. Lower resistors do make the current MORE sensitive in percentage terms, 77 percent of nominal retained at 100R against 61 at 33R, but the absolute floor is what you see and it rises. Currents read off the datasheet's own Vf/If curve at the working point, not off the 20 mA table.; SPEC: thick film +-1%, 1/16W, 0402; SymbolName_1: R-US_SMALL; DeviceName: R0402; LibraryName: rcl; DeviceSetName: R-US_SMALL
R81 = R-US_SMALLR0402: RESISTOR, American symbol, small 2-zigzag variant (sheet 2 only); GateName_1: G$1; MANF: Yageo; MANF#: RC0402FR-07330RL; NOTE: RGB LED balance. The green and blue dice are 3.3 V-class parts on a 3.3 V rail, so the resistor never dominates their current -- that is structural and no resistor value fixes it. What the values CAN do is stop red swamping the other two. As built, and as Cmod A7 ships the same LED, 182/182/100 gave red 6.9 mA against green 1.9 and blue 1.5: red about four times either. At 330/33/33 it is red 3.8, green 2.9, blue 2.9. Worst case improves too, not just nominal -- green with a part 0.15 V high in Vf goes from 1.4 mA to 1.8. Lower resistors do make the current MORE sensitive in percentage terms, 77 percent of nominal retained at 100R against 61 at 33R, but the absolute floor is what you see and it rises. Currents read off the datasheet's own Vf/If curve at the working point, not off the 20 mA table.; SPEC: thick film +-1%, 1/16W, 0402; SymbolName_1: R-US_SMALL; DeviceName: R0402; LibraryName: rcl; DeviceSetName: R-US_SMALL
R83 R84 = R-US_SMALLR0402: RESISTOR, American symbol, small 2-zigzag variant (sheet 2 only); GateName_1: G$1; MANF: Yageo; MANF#: RC0402FR-07330RL; SPEC: thick film +-1%, 1/16W, 0402; SymbolName_1: R-US_SMALL; DeviceName: R0402; LibraryName: rcl; DeviceSetName: R-US_SMALL
R85 R86 = R-US_SMALLR0402: RESISTOR, American symbol, small 2-zigzag variant (sheet 2 only); GateName_1: G$1; MANF: Yageo; MANF#: RC0402FR-0710KL; SPEC: thick film +-1%, 1/16W, 0402; SymbolName_1: R-US_SMALL; DeviceName: R0402; LibraryName: rcl; DeviceSetName: R-US_SMALL
U$2 = CC_CC: GateName_1: G$1; SymbolName_1: CC_CC; LibraryName: ctambe; DeviceSetName: CC_CC; CC: CC
U$3 = CC_BY: GateName_1: G$1; SymbolName_1: CC_BY; LibraryName: ctambe; DeviceSetName: CC_BY; BY: BY
U$4 = CC_SA: GateName_1: G$1; SymbolName_1: CC_SA; LibraryName: ctambe; DeviceSetName: CC_SA; SA: SA
U$5 = CC_COPYRIGHT: GateName_1: G$1; SymbolName_1: CC_COPYRIGHT; LibraryName: ctambe; DeviceSetName: CC_COPYRIGHT; C: C
X2 = ZULU-CONN: Zulu A7 Board Connector; SymbolName_1: PIN_GATE_IO; GateName_2: CHAN0; SymbolName_2: PIN_GATE_IN; GateName_3: CHAN1; GateName_4: CHAN2; GateName_5: CHAN3; GateName_6: CHAN4; GateName_7: CHAN5; GateName_8: CHAN6; GateName_9: CHAN7; GateName_10: CHAN8; GateName_11: CHAN9; GateName_12: CHAN10; GateName_13: CHAN11; GateName_14: +1.8V; GateName_15: +3.3V; GateName_16: GND; GateName_17: +1.0V; GateName_18: RST#; GateName_19: CHAN14; GateName_20: CHAN15; GateName_21: CHAN16; GateName_22: CHAN17; GateName_23: CHAN18; GateName_24: CHAN19; GateName_25: CHAN20; GateName_26: CHAN21; GateName_27: CHAN22; GateName_28: CHAN23; GateName_29: CHAN24; GateName_30: CHAN25; GateName_31: CHAN26; GateName_32: CHAN27; GateName_33: ANALOG-IO0; GateName_34: ANALOG-IO1; GateName_35: CHAN28; GateName_36: G$1; SymbolName_36: PV_GATE; GateName_37: GND2; GateName_38: CHAN12; GateName_39: CHAN13; GateName_40: GND4; GateName_41: VU; MANF: Sullins; MANF#: 2x PRPC009SAAN-RC + 2x PRPC011SAAN-RC; SPEC: four 0.1 in male breakaway header strips, 0.64 mm square gold-flash pins, 2.54 mm pitch, through-hole, mounted from the underside, two part numbers and two of each per board: PRPC009SAAN-RC 1x9 twice (pins 1-9 and 21-29) and PRPC011SAAN-RC 1x11 twice (pins 10-20 and 30-40); the two rows are cut identically since the LiPo landing was moved opposite the micro-USB on 2026-09-09; NOTE: Pin field ZULU-DIP37: 40 pins of 1.016 mm on 2.54 mm pitch, two rows 22.86 mm (0.900 in) apart, numbered 1-40 straight through and skipping both landings. The rows are mirror images: top row pins 1-9 (x 59.69..39.37) = GND, CHAN-CLK, CHAN0..CHAN6, FOUR positions for the micro-USB X1 (36.83..29.21), pins 10-20 (26.67..1.27) = CHAN7..CHAN13, GND, +3.3V, +1.8V, +1.0V (channel order since 2026-09-09, power pins re-ordered 2026-10-07); bottom row pins 21-29 (59.69..39.37), FOUR positions for the LiPo header X4 at the SAME four x values (36.83..29.21), pins 30-40 (26.67..1.27), so X4 sits on the top side directly opposite the edge-mounted USB receptacle. Each landing is 12.70 mm between the neighbouring pin centres, 11.176 mm clear: the JST B2B-PH-SM4-TB body is 7.95 mm, so 1.61 mm each side. Reworked 2026-09-09 from the old 44-position pattern: +5V-INPUT with D2/D3, GND5, GND3 and +3.3V2 removed, CHAN12/CHAN13 moved to pins 2/3, the bottom row closed up, the field renumbered and the landing moved. Three grounds (1, 17, 21); 3.3 V for the header is pin 18 alone; pin 22 VU sources the 4.4 V rail. THE PCB FOOTPRINT MUST BE REDRAWN with 40 pads named 1-40 in these positions -- the imported ZULU-DIP37 still names 44. Sullins PRPC strips fit the holes (0.64 mm square pins, Sullins recommends 1.02 mm). Digi-Key 2026-09-08: PRPC009SAAN-RC 1,201 at $0.18, PRPC011SAAN-RC 428 at $0.22, two of each per board (the 1x11 stock covers about 200 boards). Alternate: any 2.54 mm 1x40 breakaway strip (LCSC Boomele C2337, 81,690) cut to 9 + 11 twice.; GateName_1: CHAN-CLK; SymbolName_3: PIN_GATE_IO; SymbolName_4: PIN_GATE_IO; SymbolName_5: PIN_GATE_IO; SymbolName_6: PIN_GATE_IO; SymbolName_7: PIN_GATE_IO; SymbolName_8: PIN_GATE_IO; SymbolName_9: PIN_GATE_IN; SymbolName_10: PIN_GATE_IO; SymbolName_11: PIN_GATE_IO; SymbolName_12: PIN_GATE_IN; SymbolName_13: PIN_GATE_IO; SymbolName_14: PIN_GATE_IO; SymbolName_15: PIN_GATE_IO; SymbolName_16: PIN_GATE_IO; SymbolName_17: PIN_GATE_IO; SymbolName_18: PIN_GATE_IO; SymbolName_19: PIN_GATE_IO; SymbolName_20: PIN_GATE_IO; SymbolName_21: PIN_GATE_IN; SymbolName_22: PIN_GATE_IO; SymbolName_23: PIN_GATE_IO; SymbolName_24: PIN_GATE_IO; SymbolName_25: PIN_GATE_IO; SymbolName_26: PIN_GATE_IN; SymbolName_27: PIN_GATE_IO; SymbolName_28: PIN_GATE_IO; SymbolName_29: PIN_GATE_IN; SymbolName_30: PIN_GATE_IO; SymbolName_31: PIN_GATE_IO; SymbolName_32: PIN_GATE_IO; SymbolName_33: PIN_GATE_IO; SymbolName_34: PIN_GATE_IO; SymbolName_35: PIN_GATE_IO; SymbolName_37: PIN_GATE_IO; SymbolName_38: PIN_GATE_IO; SymbolName_39: PIN_GATE_IO; SymbolName_40: PIN_GATE_IO; SymbolName_41: PIN_GATE_IO; LibraryName: ctambe; DeviceSetName: ZULU-CONN

## Sheet zulu_a7_3.SchDoc
size 270 x 341 mm; Author: Christian Tambe; VERSION#: 1.0; Origin: Eagle; OriginPath: C:\Users\tambe\Documents\Electronics\Zulu_A7\Zulu_Altrium\zulu_a7.sch; OriginSheet: 4; OriginDescription: Memory
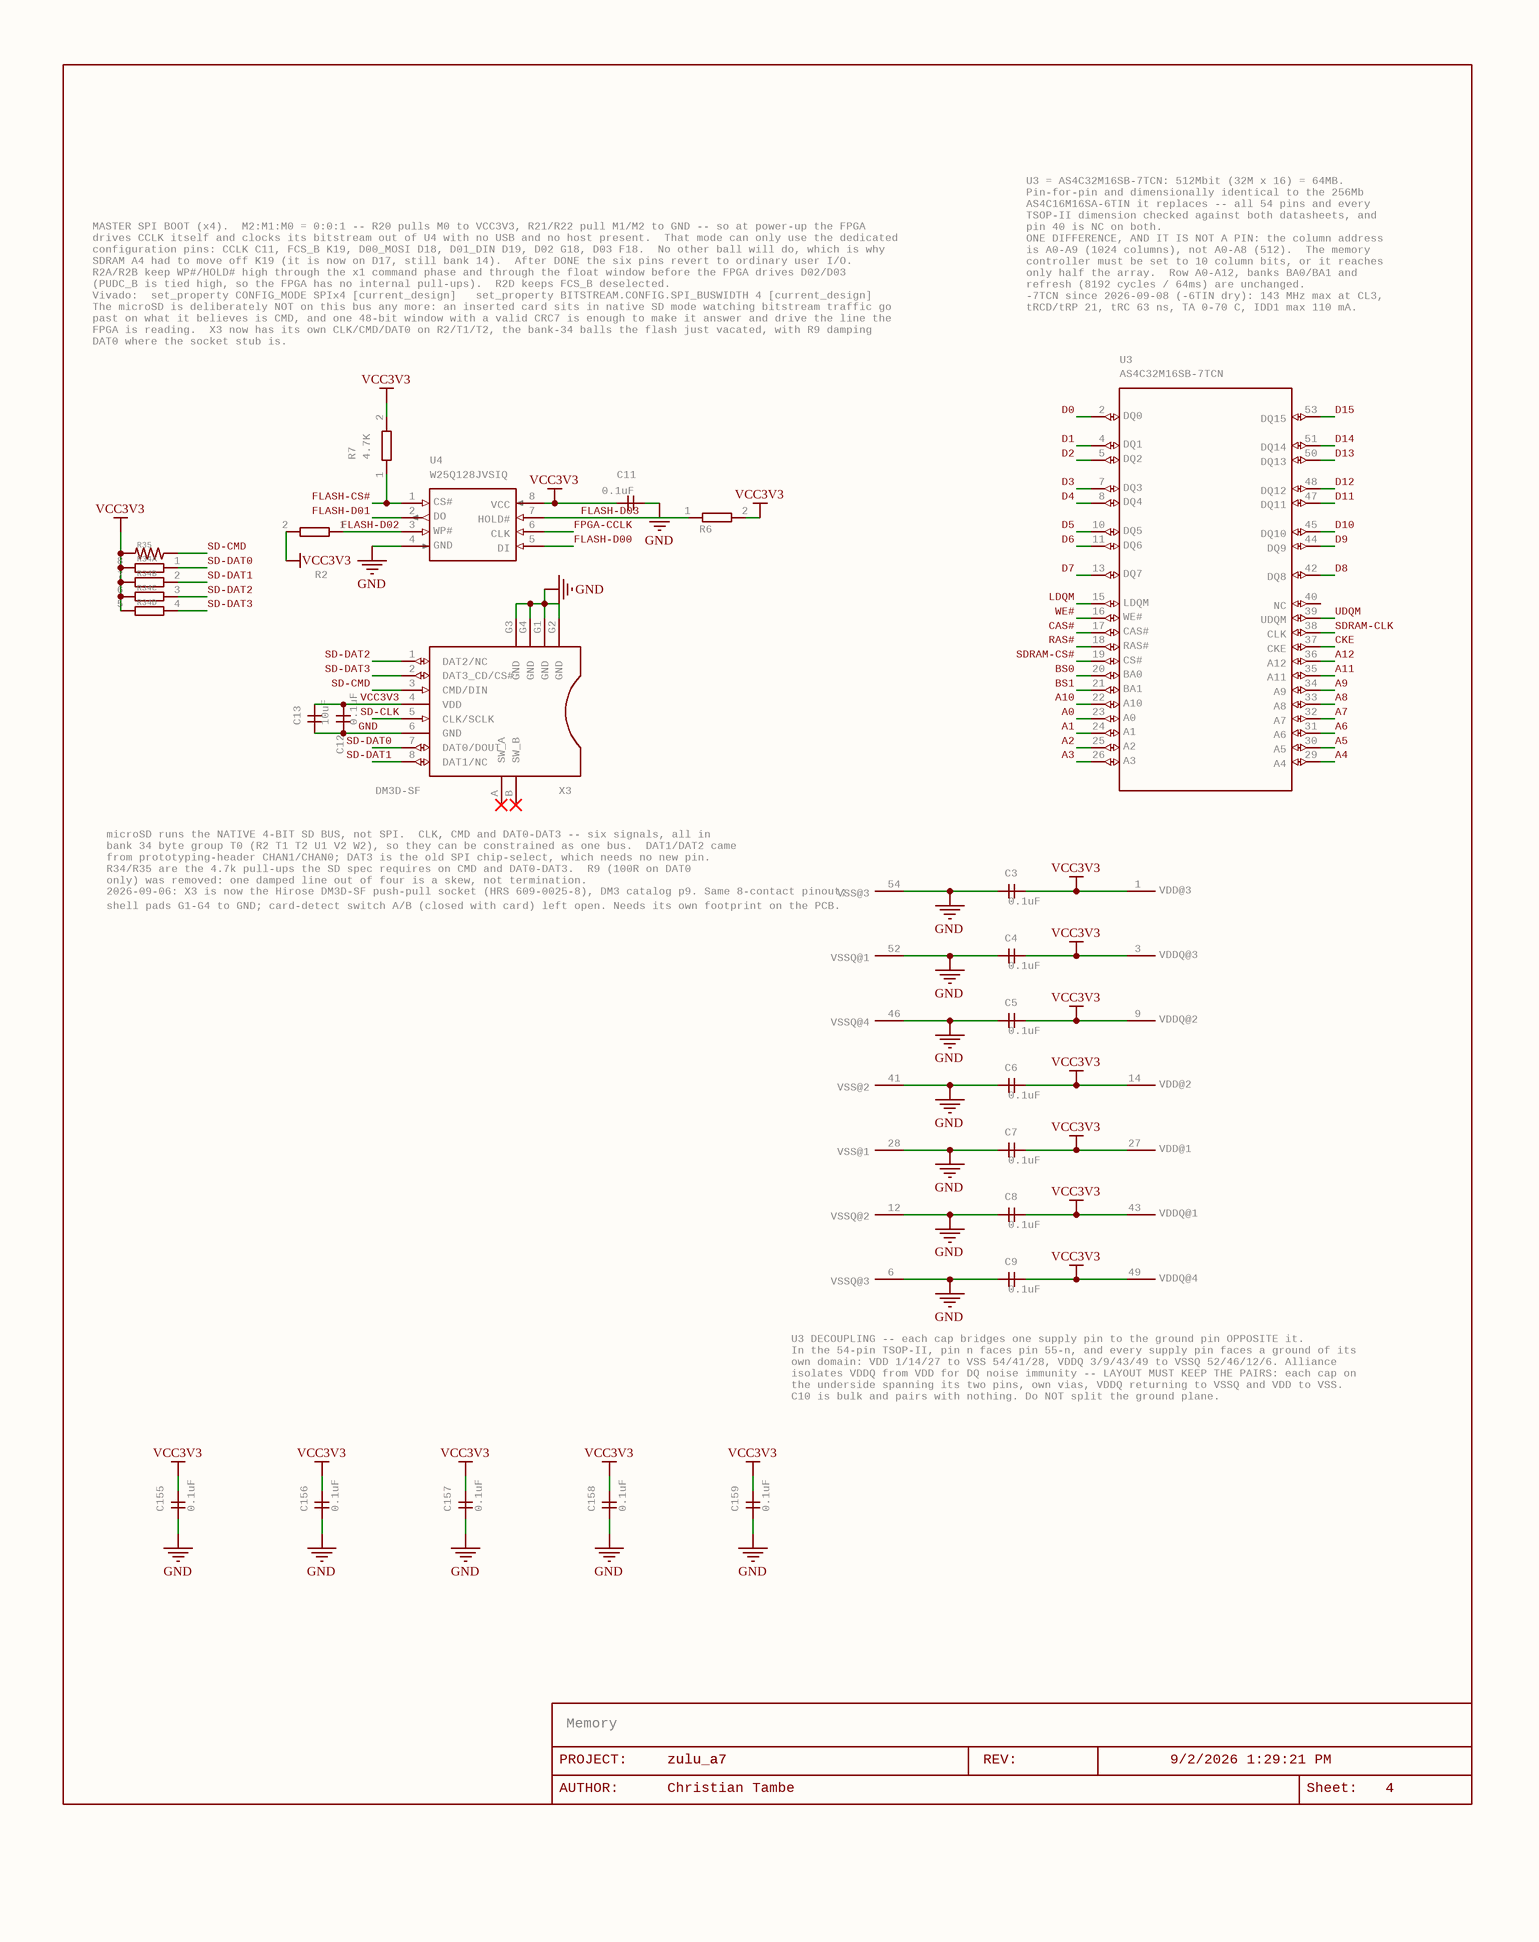
[diagram p3: zulu_a7_3.SchDoc]

### Parts
C3  0.1uF  [C0402]
C4  0.1uF  [C0402]
C5  0.1uF  [C0402]
C6  0.1uF  [C0402]
C7  0.1uF  [C0402]
C8  0.1uF  [C0402]
C9  0.1uF  [C0402]
C11  0.1uF  [C0402]
C12  0.1uF  [C0402]
C13  10uF  [C0603]
C155  0.1uF  [C0201]
C156  0.1uF  [C0201]
C157  0.1uF  [C0201]
C158  0.1uF  [C0201]
C159  0.1uF  [C0201]
FRAME7  LAST_DATE_TIME: 9/2/2026 1:29:21 PM  Sheet: Sheet:  SHEET: 4  REV: REV:  PROJECT: PROJECT:  DRAWING_NAME: zulu_a7  AUTHOR: Christian Tambe  (hidden comment: DOCFIELD)  (graphical)
R2  4.7K  [R0201]  (value not drawn)
R6  4.7K  [R0201]  (value not drawn)
R7  4.7K  [R0201]
R34  4.7K  [742C083]  (value not drawn)  (parts A,B,C,D of 4)
R35  4.7K  [R0402]  (value not drawn)
U3  AS4C32M16SB-7TCN  PART: U3  [TSOPII-54]  (parts A,B,C,D,E,F,G,H,I,J,K,L,M,N,O,P,Q,R,S,T,U,V,W,X,Y,Z,27,28,29,30,31,32,33,34,35,36,37,38,39,40,41,42,43,44,45,46,47,48,49,50,51,52,53,54,55 of 55)
U4  W25Q128JVSIQ  PART: U4  [SOIC-8_208MIL]  (parts A,B,C,D,E,F,G,H,I of 9)
X3  DM3D-SF  [DM3D-SF]

### Nets
GND: C3.1 C4.1 C5.1 C6.1 C7.1 C8.1 C9.1 C11.1 C12.1 C13.1 C155.1 C156.1 C157.1 C158.1 C159.1 U3.6(P$1) U3.12(P$1) U3.28(P$1) U3.41(P$1) U3.46(P$1) U3.52(P$1) U3.54(P$1) U4.4 X3.6(GND) X3.G1(GND) X3.G2(GND) X3.G3(GND) X3.G4(GND)
VCC3V3: C3.2 C4.2 C5.2 C6.2 C7.2 C8.2 C9.2 C11.2 C12.2 C13.2 C155.2 C156.2 C157.2 C158.2 C159.2 R2.2 R6.2 R7.2 R34.5 R34.6 R34.7 R34.8 R35.2 U3.1(P$1) U3.3(P$1) U3.9(P$1) U3.14(P$1) U3.27(P$1) U3.43(P$1) U3.49(P$1) U4.8 X3.4(VDD)
A0: U3.23(P$1)
A1: U3.24(P$1)
A2: U3.25(P$1)
A3: U3.26(P$1)
A4: U3.29(P$1)
A5: U3.30(P$1)
A6: U3.31(P$1)
A7: U3.32(P$1)
A8: U3.33(P$1)
A9: U3.34(P$1)
A10: U3.22(P$1)
A11: U3.35(P$1)
A12: U3.36(P$1)
BS0: U3.20(P$1)
BS1: U3.21(P$1)
CAS#: U3.17(P$1)
CKE: U3.37(P$1)
D0: U3.2(P$1)
D1: U3.4(P$1)
D2: U3.5(P$1)
D3: U3.7(P$1)
D4: U3.8(P$1)
D5: U3.10(P$1)
D6: U3.11(P$1)
D7: U3.13(P$1)
D8: U3.42(P$1)
D9: U3.44(P$1)
D10: U3.45(P$1)
D11: U3.47(P$1)
D12: U3.48(P$1)
D13: U3.50(P$1)
D14: U3.51(P$1)
D15: U3.53(P$1)
FLASH-CS#: R7.1 U4.1
FLASH-D00: U4.5
FLASH-D01: U4.2
FLASH-D02: R2.1 U4.3
FLASH-D03: R6.1 U4.7
FPGA-CCLK: U4.6
LDQM: U3.15(P$1)
RAS#: U3.18(P$1)
SD-CLK: X3.5(CLK/SCLK)
SD-CMD: R35.1 X3.3(CMD/DIN)
SD-DAT0: R34.1 X3.7(DAT0/DOUT)
SD-DAT1: R34.2 X3.8(DAT1/NC)
SD-DAT2: R34.3 X3.1(DAT2/NC)
SD-DAT3: R34.4 X3.2(DAT3_CD/CS#)
SDRAM-CLK: U3.38(P$1)
SDRAM-CS#: U3.19(P$1)
UDQM: U3.39(P$1)
WE#: U3.16(P$1)

Not connected (* = marked no-connect by the designer): U3 40(P$1); X3 A(SW_A)* B(SW_B)*

### Notes on the sheet
- (near U3) U3 = AS4C32M16SB-7TCN: 512Mbit (32M x 16) = 64MB.
  Pin-for-pin and dimensionally identical to the 256Mb
  AS4C16M16SA-6TIN it replaces -- all 54 pins and every
  TSOP-II dimension checked against both datasheets, and
  pin 40 is NC on both.
  ONE DIFFERENCE, AND IT IS NOT A PIN: the column address
  is A0-A9 (1024 columns), not A0-A8 (512).  The memory
  controller must be set to 10 column bits, or it reaches
  only half the array.  Row A0-A12, banks BA0/BA1 and
  refresh (8192 cycles / 64ms) are unchanged.
  -7TCN since 2026-09-08 (-6TIN dry): 143 MHz max at CL3,
  tRCD/tRP 21, tRC 63 ns, TA 0-70 C, IDD1 max 110 mA.
- MASTER SPI BOOT (x4).  M2:M1:M0 = 0:0:1 -- R20 pulls M0 to VCC3V3, R21/R22 pull M1/M2 to GND -- so at power-up the FPGA
  drives CCLK itself and clocks its bitstream out of U4 with no USB and no host present.  That mode can only use the dedicated
  configuration pins: CCLK C11, FCS_B K19, D00_MOSI D18, D01_DIN D19, D02 G18, D03 F18.  No other ball will do, which is why
  SDRAM A4 had to move off K19 (it is now on D17, still bank 14).  After DONE the six pins revert to ordinary user I/O.
  R2A/R2B keep WP#/HOLD# high through the x1 command phase and through the float window before the FPGA drives D02/D03
  (PUDC_B is tied high, so the FPGA has no internal pull-ups).  R2D keeps FCS_B deselected.
  Vivado:  set_property CONFIG_MODE SPIx4 [current_design]   set_property BITSTREAM.CONFIG.SPI_BUSWIDTH 4 [current_design]
  The microSD is deliberately NOT on this bus any more: an inserted card sits in native SD mode watching bitstream traffic go
  past on what it believes is CMD, and one 48-bit window with a valid CRC7 is enough to make it answer and drive the line the
  FPGA is reading.  X3 now has its own CLK/CMD/DAT0 on R2/T1/T2, the bank-34 balls the flash just vacated, with R9 damping
  DAT0 where the socket stub is.
- (near U3) microSD runs the NATIVE 4-BIT SD BUS, not SPI.  CLK, CMD and DAT0-DAT3 -- six signals, all in
  bank 34 byte group T0 (R2 T1 T2 U1 V2 W2), so they can be constrained as one bus.  DAT1/DAT2 came
  from prototyping-header CHAN1/CHAN0; DAT3 is the old SPI chip-select, which needs no new pin.
  R34/R35 are the 4.7k pull-ups the SD spec requires on CMD and DAT0-DAT3.  R9 (100R on DAT0
  only) was removed: one damped line out of four is a skew, not termination.
- 2026-09-06: X3 is now the Hirose DM3D-SF push-pull socket (HRS 609-0025-8), DM3 catalog p9. Same 8-contact pinout;
- shell pads G1-G4 to GND; card-detect switch A/B (closed with card) left open. Needs its own footprint on the PCB.
- U3 DECOUPLING -- each cap bridges one supply pin to the ground pin OPPOSITE it.
  In the 54-pin TSOP-II, pin n faces pin 55-n, and every supply pin faces a ground of its
  own domain: VDD 1/14/27 to VSS 54/41/28, VDDQ 3/9/43/49 to VSSQ 52/46/12/6. Alliance
  isolates VDDQ from VDD for DQ noise immunity -- LAYOUT MUST KEEP THE PAIRS: each cap on
  the underside spanning its two pins, own vias, VDDQ returning to VSSQ and VDD to VSS.
  C10 is bulk and pairs with nothing. Do NOT split the ground plane.
- (near FRAME7) Memory
- (near FRAME7) AUTHOR:

### Library data of the parts
C3-C9 C11 C12 = C-GENERICC0402: CAPACITOR, generic non-polarized, horizontal pins; GateName_1: G$1; SymbolName_1: C-GENERIC-H; MANF: Murata; MANF#: GRM155R71C104KA88D; SPEC: X7R 16V +-10%, 0.50 mm max; DeviceName: C0402; LibraryName: rcl; DeviceSetName: C-GENERIC
C13 = C-GENERICC0603: CAPACITOR, generic non-polarized, horizontal pins; GateName_1: G$1; SymbolName_1: C-GENERIC-H; MANF: Murata; MANF#: GRM188R60J106ME47D; SPEC: X5R 6.3V +-20%, 0.90 mm max; DeviceName: C0603; LibraryName: rcl; DeviceSetName: C-GENERIC
C155-C159 = C-GENERICC0201: CAPACITOR, generic non-polarized, horizontal pins; GateName_1: G$1; SymbolName_1: C-GENERIC-H; MANF: Murata; MANF#: GRM033R61A104KE15D; NOTE: RETURN-PATH STITCHING FOR THE L5 PLANE, NOT DECOUPLING.  L5 carries VCC3V3 and L2 carries GND, so a signal via that moves between an L2-referenced layer (Top, L3) and an L5-referenced one (L4, Bottom) has nowhere for its return current to go except through a VCC3V3-to-GND capacitor.  Fifty-two vias on this board do that and thirty-nine of them are the AS4C32M16SB bus; before these five parts the nearest such capacitor was a median of 3.30 mm and up to 12.70 mm away, because all forty-six sit in the y 3.0-4.2 row, round U1, or at x 2.6-7.6, and none was anywhere in x 12-39, y 6-25.4.  These five fill that hole: C155 (26.000,20.250) Top carries UDQM, CKE and A12; C156 (29.550,20.000) Bottom carries D10 and D11; C157 (39.050,18.000) Top carries D13 and is also the best path for D3 and D6; C158 (18.100,16.650) Top carries the west address row A5, A7, A9; C159 (23.300,7.500) Top carries the south control row BS0, RAS#, A0, A1, which had the worst return paths on the board.  THEIR VALUE IS IN THE PLACEMENT AND IN THE TWO VIAS BESIDE EACH ONE, NOT IN THE CAPACITANCE: with roughly 2 nH of mounting inductance a 100 nF 0201 self-resonates near 11 MHz, so at the 143 MHz bus clock and above the capacitance is irrelevant and the impedance is set entirely by the loop -- the unavoidable barrel across the 1.3512 mm L2-to-L5 cavity plus the pad-to-via tie, which is the one term a layout can shorten.  Each of these five is tied to its two planes by its own dedicated via 0.85-1.07 mm of copper away, against a 2.43 mm median for the other forty-six.  DO NOT move these parts, do not re-route or lengthen their stubs, do not delete either via, and do not substitute a larger case size: a 0402 would push the vias apart and undo the point.  If the value must change, smaller is better than larger.  Coordinates and the full measurement are in docs/stage5b_stitching_caps.md.; SPEC: X5R 10V +-10% 0201 0.1uF, 0.30 mm max -- VCC3V3-to-GND return-path stitch for the L5 plane change, added 2026-09-24; DeviceName: C0201; LibraryName: rcl; DeviceSetName: C-GENERIC
FRAME7 = DOCFIELD: DOCUMENT FIELD; GateName_1: G$1; SymbolName_1: DOCFIELD; LibraryName: ctambe; DeviceSetName: DOCFIELD
R2 R6 R7 = R-WIDER0201: RESISTOR, one element on the 0.4 in symbol   Same R1NV0 symbol the RES4 and RES8 arrays drew their elements with, so a part split out of an array keeps the exact symbol, pin span and position it had on the sheet and not one wire has to move. The 0.2 in R-US_SMALL symbol would have shifted both pins by 2.54 mm and stranded every net that touched them.; GateName_1: G$1; DeviceSetName: R-WIDE; MANF: Yageo; MANF#: RC0201FR-074K7L; SPEC: thick film +-1%, 1/20W, 0201; SymbolName_1: R1NV0; DeviceName: R0201; LibraryName: rcl
R34 = RES4742: Resistor 4-pack   Package of four resistors.; GateName_1: A; SymbolName_1: R1NV0; GateName_2: B; GateName_3: C; GateName_4: D; DeviceName: 742; DeviceSetName: RES4; MANF: CTS; MANF#: 742C083472JP; NOTE: The microSD DAT0-3 pull-ups, all four elements used -- which is what an array is actually for. R1, R2 and R4 used 2, 3 and 6 of theirs in the EAGLE original and were split into discretes during the import; on 2026-09-09 R1 and R4 went back into arrays of their own (742C043472JP and 742C163101JP), so all three arrays on this board are CTS 74x concave parts sharing one land-pattern rule. R2 is still a discrete. 4.7k is the conventional value for SD data lines and it was already chosen; only the part number was missing. 5 percent is ample for a pull-up, so this is a J part where the discrete resistors on this board are F. CTS 742C is the family the footprint is named after. Confirm the suffix -- it encodes tolerance and packaging and is the easy thing to get wrong.; SPEC: 4x4.7K isolated array 0603x4, 0.8 mm pitch; direct successor of the obsolete JTR; SymbolName_2: R1NV0; SymbolName_3: R1NV0; SymbolName_4: R1NV0; LibraryName: ctambe; DIGIKEY#: 742C083???JPCT-ND; MOUSER#: 774-742C083???JP
R35 = R-US_R0402: RESISTOR, American symbol; GateName_1: G$1; SymbolName_1: R-US; DeviceSetName: R-US_; MANF: Yageo; MANF#: RC0402FR-074K7L; SPEC: thick film +-1%, 1/16W, 0402; DeviceName: R0402; LibraryName: rcl
U3 = SDRAM-X16-ALLIANCE-512M: SDR SDRAM, x16, 54-pin TSOP-II   The 54-pin TSOP-II x16 SDR pinout is identical for 256Mb and 512Mb: both use row A0-A12 with banks BA0/BA1, and pin 40 is NC on both. They differ only in the column address width -- A0-A8 (512 columns) at 256Mb, A0-A9 (1024 columns) at 512Mb -- which is a memory-controller setting, not a wiring change.; GateName_1: PART_VALUE; SymbolName_1: PART_VALUE-SDRAM-X16; GateName_2: VDD@3; SymbolName_2: PL-SDRAM-X16; GateName_3: DQ0; GateName_4: VDDQ@3; GateName_5: DQ1; GateName_6: DQ2; GateName_7: VSSQ@3; GateName_8: DQ3; GateName_9: DQ4; GateName_10: VDDQ@2; GateName_11: DQ5; GateName_12: DQ6; GateName_13: VSSQ@2; GateName_14: DQ7; GateName_15: VDD@2; GateName_16: LDQM; GateName_17: WE#; GateName_18: CAS#; GateName_19: RAS#; GateName_20: CS#; GateName_21: BA0; GateName_22: BA1; GateName_23: A10; GateName_24: A0; GateName_25: A1; GateName_26: A2; GateName_27: A3; GateName_28: VDD@1; GateName_29: VSS@1; GateName_30: A4; GateName_31: A5; GateName_32: A6; GateName_33: A7; GateName_34: A8; GateName_35: A9; GateName_36: A11; GateName_37: A12; GateName_38: CKE; GateName_39: CLK; GateName_40: UDQM; GateName_42: VSS@2; GateName_43: DQ8; GateName_44: VDDQ@1; GateName_45: DQ9; GateName_46: DQ10; GateName_47: VSSQ@4; GateName_48: DQ11; GateName_49: DQ12; GateName_50: VDDQ@4; GateName_51: DQ13; GateName_52: DQ14; GateName_53: VSSQ@1; GateName_54: DQ15; GateName_55: VSS@3; MANF: Alliance Memory; NOTE: 512Mbit (32M x 16) = 64MB. Pin-for-pin and dimensionally identical to the 256Mb AS4C16M16SA-6TIN it replaces: all 54 pins and every TSOP-II dimension were checked against both datasheets, and pin 40 is NC on both. ONE DIFFERENCE, AND IT IS NOT A PIN -- the column address is A0-A9 (1024 columns) instead of A0-A8 (512). The memory controller must be set to 10 column bits or it reaches only half the array. Row A0-A12, banks BA0/BA1 and refresh (8192 cycles/64ms) are unchanged. IDD1 rises 60mA to 120mA on the 600mA VCC3V3 buck (LTC3569 SW3). 2026-09-08: AS4C32M16SB-6TIN replaced by AS4C32M16SB-7TCN (same B die, 54-TSOP II 400 mil and pinout, datasheet Rev 1.4 Table 2): -7 speed bin, 143 MHz max at CL3 (tCK 7 ns, tAC 5.4 ns), tRCD/tRP 21 ns, tRC/tRFC 63 ns, tRRD/tMRD/tWR 14 ns, tCH/tCL 2.5 ns; 100 MHz at CL2 for every grade. Commercial TA 0..70 C, matching the -1C FPGA. IDD1 max 110 mA (was 120). AS4C32M16SB-7TIN (industrial) is the timing-identical alternate; the -6TIN only if the controller is clocked above 143 MHz.; SymbolName_3: PL-SDRAM-X16; SymbolName_4: PL-SDRAM-X16; SymbolName_5: PL-SDRAM-X16; SymbolName_6: PL-SDRAM-X16; SymbolName_7: PL-SDRAM-X16; SymbolName_8: PL-SDRAM-X16; SymbolName_9: PL-SDRAM-X16; SymbolName_10: PL-SDRAM-X16; SymbolName_11: PL-SDRAM-X16; SymbolName_12: PL-SDRAM-X16; SymbolName_13: PL-SDRAM-X16; SymbolName_14: PL-SDRAM-X16; SymbolName_15: PL-SDRAM-X16; SymbolName_16: PL-SDRAM-X16; SymbolName_17: PL-SDRAM-X16; SymbolName_18: PL-SDRAM-X16; SymbolName_19: PL-SDRAM-X16; SymbolName_20: PL-SDRAM-X16; SymbolName_21: PL-SDRAM-X16; SymbolName_22: PL-SDRAM-X16; SymbolName_23: PL-SDRAM-X16; SymbolName_24: PL-SDRAM-X16; SymbolName_25: PL-SDRAM-X16; SymbolName_26: PL-SDRAM-X16; SymbolName_27: PL-SDRAM-X16; SymbolName_28: PL-SDRAM-X16; SymbolName_29: PL-SDRAM-X16; SymbolName_30: PL-SDRAM-X16; SymbolName_31: PL-SDRAM-X16; SymbolName_32: PL-SDRAM-X16; SymbolName_33: PL-SDRAM-X16; SymbolName_34: PL-SDRAM-X16; SymbolName_35: PL-SDRAM-X16; SymbolName_36: PL-SDRAM-X16; SymbolName_37: PL-SDRAM-X16; SymbolName_38: PL-SDRAM-X16; SymbolName_39: PL-SDRAM-X16; SymbolName_40: PL-SDRAM-X16; GateName_41: NC; SymbolName_41: PL-SDRAM-X16; SymbolName_42: PL-SDRAM-X16; SymbolName_43: PL-SDRAM-X16; SymbolName_44: PL-SDRAM-X16; SymbolName_45: PL-SDRAM-X16; SymbolName_46: PL-SDRAM-X16; SymbolName_47: PL-SDRAM-X16; SymbolName_48: PL-SDRAM-X16; SymbolName_49: PL-SDRAM-X16; SymbolName_50: PL-SDRAM-X16; SymbolName_51: PL-SDRAM-X16; SymbolName_52: PL-SDRAM-X16; SymbolName_53: PL-SDRAM-X16; SymbolName_54: PL-SDRAM-X16; SymbolName_55: PL-SDRAM-X16; DeviceName: -ALLIANCE-512M; LibraryName: ctambe; DeviceSetName: SDRAM-X16; MANF#: AS4C32M16SB-7TCN
U4 = SPI_FLASH-SOIC_150_208: SPI Flash; GateName_1: PART; SymbolName_1: PV_GATE; GateName_2: CS#; SymbolName_2: PIN_GATE_IN; GateName_3: DO; SymbolName_3: PIN_GATE_OUT; GateName_4: WP#; GateName_5: GND; GateName_6: DI; GateName_7: CLK; GateName_8: HOLD#; GateName_9: VCC; MANF: Winbond; NOTE: 128Mbit quad SPI, SOIC-8 208mil. The XC7A35T bitstream is 17,536,096 bits, so the previous W25Q80BV (8Mbit) could not boot the part at all. 128Mbit leaves ~14MB for user data above the bitstream.; SymbolName_4: PIN_GATE_IN; SymbolName_5: PIN_GATE_IN; SymbolName_6: PIN_GATE_IN; SymbolName_7: PIN_GATE_IN; SymbolName_8: PIN_GATE_IN; SymbolName_9: PIN_GATE_IN; DeviceName: -SOIC_150_208; LibraryName: ctambe; DeviceSetName: SPI_FLASH; DIGIKEY#: W25Q128JVSIQ-ND; MANF#: W25Q128JVSIQ
X3 = MICROSD_CONDM3D-SF: microSD socket, push-pull, Hirose DM3D-SF; GateName_1: G$1; HRS#: 609-0025-8; SPEC: microSD push-pull (no eject), top mount, 0.5 A; 8 contacts + 4 shell pads G1-G4 + card-detect switch A/B (open without card); DM3 catalog p9; SymbolName_1: MICROSD_CON; DeviceName: DM3D-SF; LibraryName: ctambe; DeviceSetName: MICROSD_CON; MANF: Hirose; MANF#: DM3D-SF; MOUSER#: MOUSER#